# Altium schematic sheet MCU.SchDoc
size A; SheetNumber: 3; SheetTotal: 8
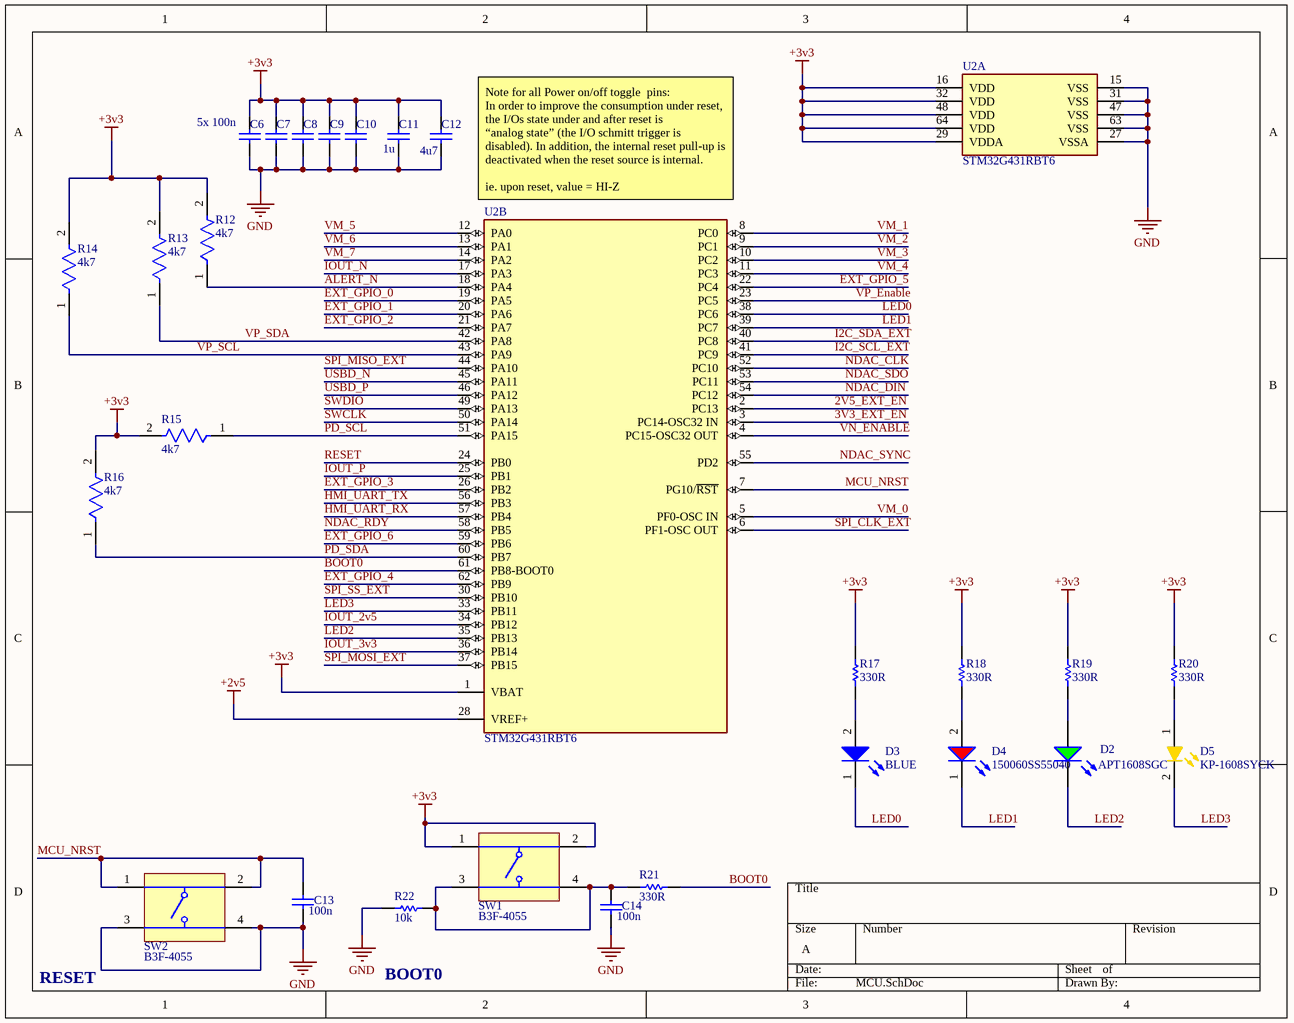
[diagram p0: MCU.SchDoc]

## Parts
C6  100n 0805  [CAPC2013X145X50NL20T25]  (value not drawn)
C7  100n 0805  [CAPC2013X145X50NL20T25]  (value not drawn)
C8  100n 0805  [CAPC2013X145X50NL20T25]  (value not drawn)
C9  100n 0805  [CAPC2013X145X50NL20T25]  (value not drawn)
C10  100n 0805  [CAPC2013X145X50NL20T25]  (value not drawn)
C11  1u  [CAPC2013X145X50NL20T25]
C12  4u7  [CAPC2013X145X50NL20T25]
C13  100n  [CAPC2013X145X50NL20T25]
C14  100n  [CAPC2013X145X50NL20T25]
D2  APT1608SGC  [KING-APT1608SGC_V]
D3  BLUE  [WL-SMCW_0603_150060xx75000]
D4  150060SS55040  [WL-SMCD_0603]
D5  KP-1608SYCK  [KING-0603LED_YELLOW_V]
R12  4k7  [FP-AC0603-IPC_A]
R13  4k7  [FP-AC0603-IPC_A]
R14  4k7  [FP-AC0603-IPC_A]
R15  4k7  [FP-AC0603-IPC_A]
R16  4k7  [FP-AC0603-IPC_A]
R17  330R  [RESC1608X55X25NL10T15]
R18  330R  [RESC1608X55X25NL10T15]
R19  330R  [RESC1608X55X25NL10T15]
R20  330R  [RESC1608X55X25NL10T15]
R21  330R  [RESC1608X55X30NL15T15]
R22  10k  [RESC1608X55X30NL15T15]
SW1  B3F-4055  [OMRON-B3F-4055_V]
SW2  B3F-4055  [OMRON-B3F-4055_V]
U2  STM32G431RBT6  [FP-LQFP64-5W-MFG]  (parts A,B of 2)

## Nets
+2v5: U2.28(VREF+)
+3v3: C6.2 C7.2 C8.2 C9.2 C10.2 C11.2 C12.2 R12.2 R13.2 R14.2 R15.2 R16.2 R17.2 R18.2 R19.2 R20.2 SW1.1 SW1.2 U2.1(VBAT) U2.16(VDD) U2.29(VDDA) U2.32(VDD) U2.48(VDD) U2.64(VDD)
GND: C6.1 C7.1 C8.1 C9.1 C10.1 C11.1 C12.1 C13.1 C14.1 R22.1 SW2.3 SW2.4 U2.15(VSS) U2.27(VSSA) U2.31(VSS) U2.47(VSS) U2.63(VSS)
2V5_EXT_EN: U2.2(PC13)
3V3_EXT_EN: U2.3(PC14-OSC32_IN)
ALERT_N: R12.1 U2.18(PA4)
BOOT0: R21.2 U2.61(PB8-BOOT0)
EXT_GPIO_0: U2.19(PA5)
EXT_GPIO_1: U2.20(PA6)
EXT_GPIO_2: U2.21(PA7)
EXT_GPIO_3: U2.26(PB2)
EXT_GPIO_4: U2.62(PB9)
EXT_GPIO_5: U2.22(PC4)
EXT_GPIO_6: U2.59(PB6)
HMI_UART_RX: U2.57(PB4)
HMI_UART_TX: U2.56(PB3)
I2C_SCL_EXT: U2.41(PC9)
I2C_SDA_EXT: U2.40(PC8)
IOUT_2v5: U2.34(PB12)
IOUT_3v3: U2.36(PB14)
IOUT_N: U2.17(PA3)
IOUT_P: U2.25(PB1)
LED0: D3.1(K) U2.38(PC6)
LED1: D4.1(K) U2.39(PC7)
LED2: D2.2(K) U2.35(PB13)
LED3: D5.2(K) U2.33(PB11)
MCU_NRST: C13.2 SW2.1 SW2.2 U2.7(PG10/~{RST})
NDAC_CLK: U2.52(PC10)
NDAC_DIN: U2.54(PC12)
NDAC_RDY: U2.58(PB5)
NDAC_SDO: U2.53(PC11)
NDAC_SYNC: U2.55(PD2)
PD_SCL: R15.1 U2.51(PA15)
PD_SDA: R16.1 U2.60(PB7)
RESET: U2.24(PB0)
SPI_CLK_EXT: U2.6(PF1-OSC_OUT)
SPI_MISO_EXT: U2.44(PA10)
SPI_MOSI_EXT: U2.37(PB15)
SPI_SS_EXT: U2.30(PB10)
SWCLK: U2.50(PA14)
SWDIO: U2.49(PA13)
USBD_N: U2.45(PA11)
USBD_P: U2.46(PA12)
VM_0: U2.5(PF0-OSC_IN)
VM_1: U2.8(PC0)
VM_2: U2.9(PC1)
VM_3: U2.10(PC2)
VM_4: U2.11(PC3)
VM_5: U2.12(PA0)
VM_6: U2.13(PA1)
VM_7: U2.14(PA2)
VN_ENABLE: U2.4(PC15-OSC32_OUT)
VP_Enable: U2.23(PC5)
VP_SCL: R14.1 U2.43(PA9)
VP_SDA: R13.1 U2.42(PA8)
NetC14_2: C14.2 R21.1 R22.2 SW1.3 SW1.4
NetD2_1: D2.1(A) R19.1
NetD3_2: D3.2(A) R17.1
NetD4_2: D4.2(A) R18.1
NetD5_1: D5.1(A) R20.1

## Notes on the sheet
- (near C6) 5x 100n
- Note for all Power on/off toggle  pins:
  In order to improve the consumption under reset, the I/Os state under and after reset is
  “analog state” (the I/O schmitt trigger is disabled). In addition, the internal reset pull-up is
  deactivated when the reset source is internal.
  ie. upon reset, value = HI-Z
- RESET
- BOOT0

## Library data of the parts
C6-C14 = CMP-2007-01213-1: Part Number: C0805C106M9RACTU; Manufacturer: Kemet
D2 = CMP-2000-05789-1: Super Bright Green LED, 62.5 mW, 25 mA, -40 to 85 degC, 2-Pin SMD, RoHS, Tape and Reel; Manufacturer: Kingbright; Online Catalog: 0603RectanglewithFlatTopChipLEDs; Wavelength - Dominant: 568nm; Wavelength - Peak: 565nm; Voltage - Forward (Vf) (Typ): 2.2V; Lens Type: Clear; Other Names: 754-1121-2; Millicandela Rating: 15mcd; Catalog Drawings: APT1608SeriesTop / APT1608SeriesSide; Lens Style/Size: RectanglewithFlatTop,1.2mmx0.8mm; Current - Test: 20mA; 3D Model: APT1608x.sldprt / APT1608x.pro / APT1608x.igs / APT1608x.stp; Viewing Angle: 120°; Package / Case: 0603(1608Metric); Category: Optoelectronics; Package Description: 2-Pin Surface Mount Device, Body 0.8 x 1.6 mm; Mounting Type: SurfaceMount; Color: Green; Height: 0.75mm; Datasheet Version: Rev. 16B, 02/2012; Family: LEDIndication-Discrete; Manufacturer URL: http://www.kingbright.com/; Package Reference: APT1608SGC; Datasheet URL: https://datasheet.ciiva.com/2113/apt1608sgc-2113808.pdf; Mounting Technology: SurfaceMount; Packaging: Tape&Reel(TR); Standard Package: 2,000; Size / Dimension: 1.60mmLx0.80mmW
D3 = CMP-1426-00003-4: Led, Blue, 470 Nm, 3.2 V, 30 Ma, 145 Mcd Rohs Compliant: Yes; Peak Wavelength: 465nm; Dominant Wavelength: 470nm; Power Dissipation: 105mW; Viewing Angle: 140°; Test Current: 20mA; Max Junction Temperature (Tj): 95°C; Forward Current: 100mA; Reverse Voltage: 5V; Luminous Intensity: 145mcd; Lens Style: Clear, Rectangular; Forward Voltage: 3.2V; RoHS: Compliant; Min Operating Temperature: -40°C; REACH SVHC: Unknown; Max Operating Temperature: 85°C; Width: 800µm; Case Code (Imperial): 0603; Case Code (Metric): 1608; Max Reverse Voltage (DC): 5V; Height: 700µm; Case/Package: 0603; Mount: Surface Mount; Packaging: Tape and Reel; Color: Blue; Wavelength: 470nm; Length: 1.6mm
D4 = CMP-03913-90235567-2: 150060SS55040 WL-SMCD SMT Mono-color Chip LED Diffused; Max Reverse Voltage (DC): 5V; Luminous Intensity: 70mcd; Forward Current: 40mA; Wavelength: 630nm; Peak Wavelength: 645nm; Viewing Angle: 140°; Forward Voltage: 2V; Packaging: Tape and Reel; Length: 1.6mm; Height: 400µm; Min Operating Temperature: -40°C; NexarPartId: 90235567; Dominant Wavelength: 630nm; Width: 800µm; Max Operating Temperature: 85°C; RoHS: Compliant
D5 = CMP-0404-00003-1: LED, SMT, 0603(1608), 1.1mm thickness, Yellow; Manufacturer: Kingbright; Reverse Voltage: 5 V; Packing Type: 2000 pcs / reel; Forward Current: 30 mA; Power Dissipation: 75 mW; ComponentLink2URL: http://www.kingbright.com/manager/upload/pdf/(1366274739)KP-1608SYCK(Ver.18B).pdf; PartNumber: KP-1608SYCK; ComponentLink1URL: http://www.kingbright.com/; ComponentLink2Description: Datasheet; PackageDescription: 2-Pin SMT LED, 1.6 x 0.8 mm Pitch; PackageReference: 0603LED_YELLOW; ComponentLink1Description: Manufacturer URL; Storage Temperature: -40 to +85 degC; Mounting Technology: Surface Mount
R12-R16 = CMP-03412-006483-2: RES 4.7KΩ 1.00% 0.1W 0603; Tolerance: 1%; Resistance: 4.7kR; Case/Package: 0603; RoHS Compliant: Yes
R17-R20 = CMP-1659-00020-2: Chip Resistor, 330 Ohm, +/- 1%, 0.1 W, -55 to 155 degC, 0603 (1608 Metric), RoHS, Tape and Reel; Tolerance: 10%; ESR: 800 mohm; Voltage Rating (DC): 16 V; Capacitance: 47 uF; Length: 7.3 mm; ComponentLink1URL: http://www.yageo.com/; Packaging: Tape and Reel; Pins: 2; ComponentLink1Description: Manufacturer URL; Case Code (Imperial): 2917; REACH SVHC: No SVHC; Width: 4.3 mm; ComponentLink2Description: Datasheet; Voltage Rating: 16 V; RoHSCompliant: True; Max Operating Temperature: 125degC; ComponentLink2URL: http://www.yageo.com/documents/recent/PYu-RC_Group_51_RoHS_L_04.pdf; Min Operating Temperature: -55degC; Case/Package: 2917; Radiation Hardening: No; DatasheetVersion: Rev. 4, 02/2016; Mount: Surface Mount; PackageReference: 0603; Package Quantity: 500; Case Code (Metric): 7343; PackageDescription: 2-Pin Surface Mount Device, Body 1.6 x 0.8 mm; Height: 3.1 mm
R21 R22 = CMP-2000-00258-1: Part Number: ERJ-3EKF1502V; Manufacturer: Panasonic
SW1 SW2 = CMP-2000-05902-1: Tactile Switch, 1 to 50 mA, 100 mOhm Max, 5 to 24 VDC, -25 to 70 degC, 4-Pin THD, RoHS, Bulk; Manufacturer: OmronElectronics; Contact Rating @ Voltage: 0.05@24VDCA; Pole Throw Configuration: SPST; Dielectric Strength: 500VAC; Maximum DC Voltage Rating: 24V; Electrical Life: 1000000Cycles; Product Weight: 0.85g; Switch Configuration: N.O.; Actuator Style: ProjectedPlunger; Actuator Color: Orange; Actuator Length: 3mm; Illumination Type: N/R; Body Orientation: Straight; Operating Force: 2.55N; Ground Terminal: No; Datasheet URL: https://datasheet.ciiva.com/20148/78-0136-20148640.pdf; Seal Location: N/A; Mechanical Life: N/A; Operating Temperature: -25to70C; Maximum AC Voltage Rating: N/A; Dimension: 12x12x7.3mm; Minimum Insulation Resistance: 100MOhm; Mounting: ThroughHole,PCPins; Housing Material: N/A; Packaging: Bag; Part No: B3F-4055; Maximum Contact Resistance: 100mOhm; Base Material: N/A; Manufacturer URL: http://www.omron.com/; RoHS: Yes; Contact Material: N/A; Package Description: 4-Pin Through Hole Device, Body 12 x 12 mm; Family: B3F; Mounting Technology: ThroughHole; Package Reference: B3F-4055; Contact Plating: Gold; Seal Description: N/A; Type: Miniature; Datasheet Version: 06/2009
U2 = CMP-12105-000150-1: IC MCU 32BIT 128KB FLASH 64LQFP; RoHS Compliant: Yes